# EAGLE design fallBz2 (EAGLE 7.4.0)
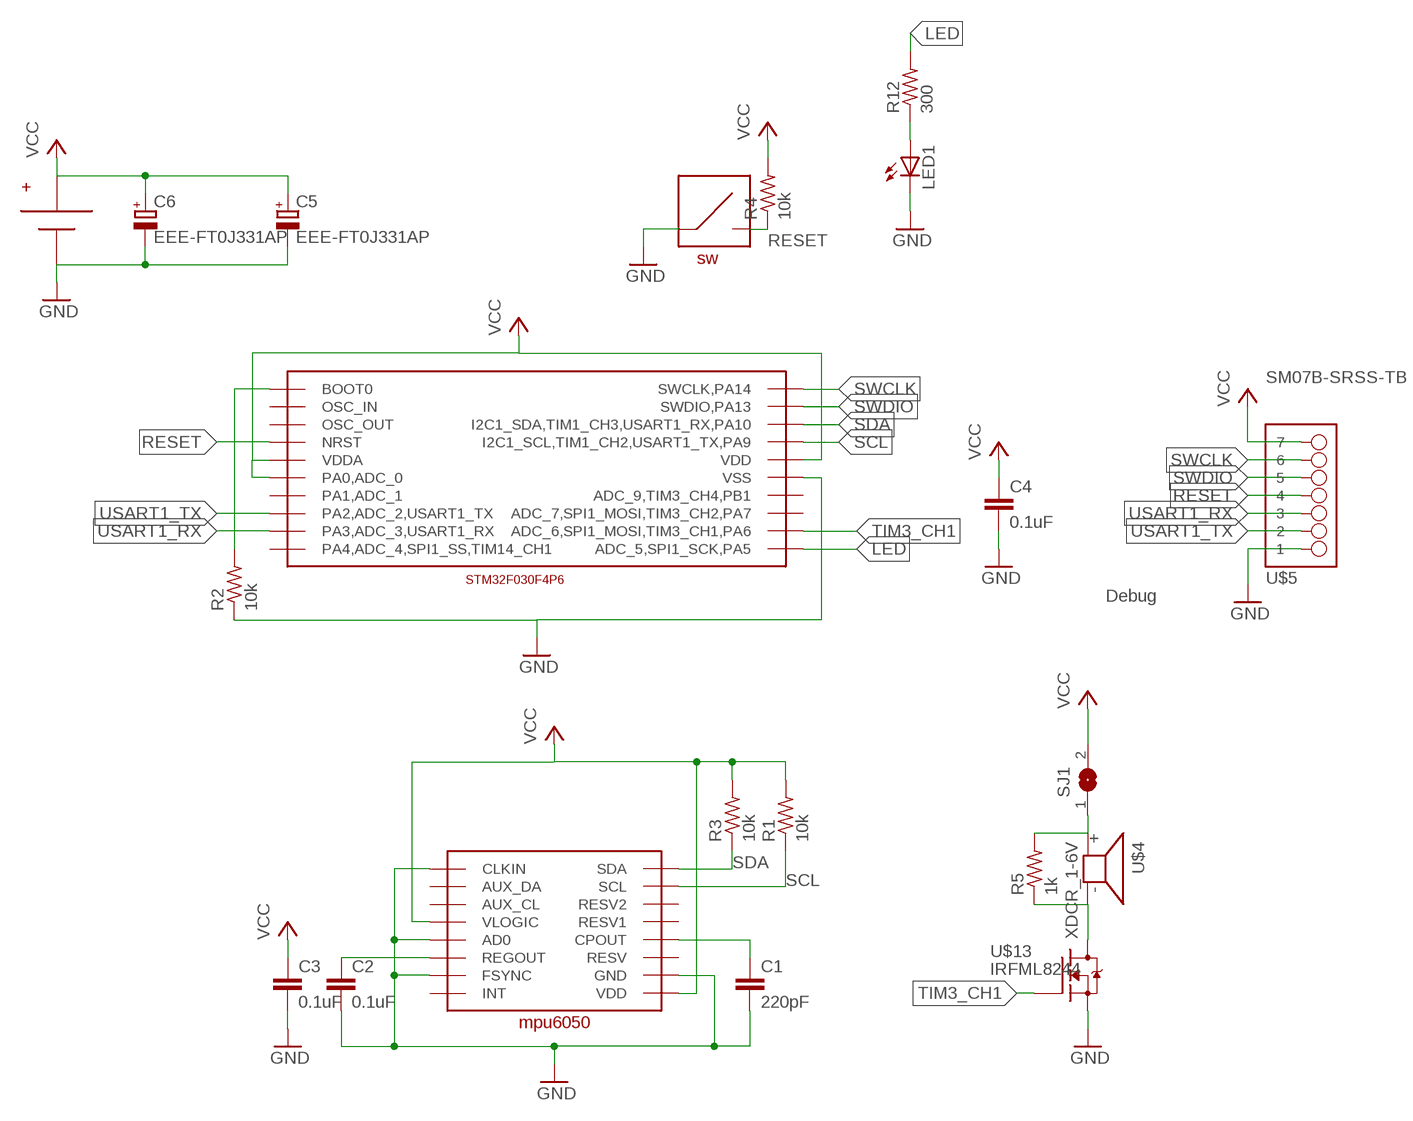
[diagram p0: schematic, sheet 1]

## Parts
C1  220pF  C-EUC0603K  [C0603K]
C2  0.1uF  C-EUC0603K  [C0603K]
C3  0.1uF  C-EUC0603K  [C0603K]
C4  0.1uF  C-EUC0603K  [C0603K]
C5  EEE-FT0J331AP  CPOL-EU153CLV-0605  [153CLV-0605]
C6  EEE-FT0J331AP  CPOL-EU153CLV-0605  [153CLV-0605]
LED1  LEDCHIP-LED0603  [CHIP-LED0603]
R1  10k  R-US_R0603  [R0603]
R2  10k  R-US_R0603  [R0603]
R3  10k  R-US_R0603  [R0603]
R4  10k  R-US_R0603  [R0603]
R5  1k  R-US_R0603  [R0603]
R12  300  R-US_R0603  [R0603]
SJ1  SJ  [SJ]
U$1  STM-TSSOP20  [STM-TSSOP20]
U$2  BAT_BK-912  [BAT_BK-912]
U$3  MPU6050  [MPU6050]
U$4  XDCR_1-6V  [XDCR_1-6V]
U$5  SM07B-SRSS-TB  [SM07B-SRSS-TB]
U$7  KMT071-NGJ-LHS  [KMT071-NGJ-LHS]
U$13  IRFML8244  [SOT23]

## Nets
GND: C1.2 C2.2 C3.2 C4.2 C5.- C6.- LED1.C R2.1 U$1.P$15(VSS) U$2.MINUS(MINSU) U$3.AD0 U$3.CLKIN U$3.FSYNC U$3.GND U$5.P$1 U$7.SW00 U$7.SW0 U$13.2(S)
LED: R12.2 U$1.P$11(ADC_5,SPI1_SCK,PA5)
N$1: C2.1 U$3.REGOUT
N$2: R5.2 SJ1.1 U$4.PLUS
N$3: R5.1 U$4.MINUS U$13.3(D)
N$5: C1.1 U$3.CPOUT
N$8: R2.2 U$1.P$1(BOOT0)
N$16: LED1.A R12.1
RESET: R4.1 U$1.P$4(NRST) U$5.P$4 U$7.SW1 U$7.SW11
SCL: R1.1 U$1.P$17(I2C1_SCL,TIM1_CH2,USART1_TX,PA9) U$3.SCL
SDA: R3.1 U$1.P$18(I2C1_SDA,TIM1_CH3,USART1_RX,PA10) U$3.SDA
SWCLK: U$1.P$20(SWCLK,PA14) U$5.P$6
SWDIO: U$1.P$19(SWDIO,PA13) U$5.P$5
TIM3_CH1: U$1.P$12(ADC_6,SPI1_MOSI,TIM3_CH1,PA6) U$13.1(G)
USART1_RX: U$1.P$9(PA3,ADC_3,USART1_RX) U$5.P$3
USART1_TX: U$1.P$8(PA2,ADC_2,USART1_TX) U$5.P$2
VCC: C3.1 C4.1 C5.+ C6.+ R1.2 R3.2 R4.2 SJ1.2 U$1.P$5(VDDA) U$1.P$6(PA0,ADC_0) U$1.P$16(VDD) U$2.P$1(PLUS) U$2.P$2(PLUS) U$3.VDD U$3.VLOGIC U$5.P$7
Unconnected: U$1.P$2(OSC_IN) U$1.P$3(OSC_OUT) U$1.P$7(PA1,ADC_1) U$1.P$10(PA4,ADC_4,SPI1_SS,TIM14_CH1) U$1.P$13(ADC_7,SPI1_MOSI,TIM3_CH2,PA7) U$1.P$14(ADC_9,TIM3_CH4,PB1) U$3.AUX_CL U$3.AUX_DA U$3.INT U$3.RESV U$3.RESV1 U$3.RESV2

## Notes on the sheet
- Debug

## Library data of the parts
C1-C4 = resistor:C-EU: CAPACITOR, European symbol
C5 C6 = rcl:CPOL-EU: POLARIZED CAPACITOR, European symbol
LED1 = led:LED: LED OSRAM: - CHIPLED LG R971, LG N971, LY N971, LG Q971, LY Q971, LO R971, LY R971 LH N974, LH R974 LS Q976, LO Q976, LY Q976 LO Q996 - Hyper CHIPLED LW Q18S LB Q993, LB Q99A, LB R99A - SideLED LS A670, LO A670, LY A670, LG A670, LP A670 LB A673, LV A673, LT A673, LW A673 LH A674 LY A675 LS A676, LA A676, LO A676, LY A676, LW A676 LS A679, LY A679, LG A679 - Hyper Micro SIDELED® LS Y876, LA Y876, LO Y876, LY Y876 LT Y87S - SmartLED LW L88C, LW L88S LB L89C, LB L89S, LG L890 LS L89K, LO L89K, LY L89K LS L896, LA L896, LO L896, LY L896 - TOPLED LS T670, LO T670, LY T670, LG T670, LP T670 LSG T670, LSP T670, LSY T670, LOP T670, LYG T670 LG T671, LOG T671, LSG T671 LB T673, LV T673, LT T673, LW T673 LH T674 LS T676, LA T676, LO T676, LY T676, LB T676, LH T676, LSB T676, LW T676 LB T67C, LV T67C, LT T67C, LS T67K, LO T67K, LY T67K, LW E67C LS E67B, LA E67B, LO E67B, LY E67B, LB E67C, LV E67C, LT E67C LW T67C LS T679, LY T679, LG T679 LS T770, LO T770, LY T770, LG T770, LP T770 LB T773, LV T773, LT T773, LW T773 LH T774 LS E675, LA E675, LY E675, LS T675 LS T776, LA T776, LO T776, LY T776, LB T776 LHGB T686 LT T68C, LB T68C - Hyper Mini TOPLED® LB M676 - Mini TOPLED Santana® LG M470 LS M47K, LO M47K, LY M47K Source: http://www.osram.convergy.de LUXEON: - LUMILED® LXK2-PW12-R00, LXK2-PW12-S00, LXK2-PW14-U00, LXK2-PW14-V00 LXK2-PM12-R00, LXK2-PM12-S00, LXK2-PM14-U00 LXK2-PE12-Q00, LXK2-PE12-R00, LXK2-PE12-S00, LXK2-PE14-T00, LXK2-PE14-U00 LXK2-PB12-K00, LXK2-PB12-L00, LXK2-PB12-M00, LXK2-PB14-N00, LXK2-PB14-P00, LXK2-PB14-Q00 LXK2-PR12-L00, LXK2-PR12-M00, LXK2-PR14-Q00, LXK2-PR14-R00 LXK2-PD12-Q00, LXK2-PD12-R00, LXK2-PD12-S00 LXK2-PH12-R00, LXK2-PH12-S00 LXK2-PL12-P00, LXK2-PL12-Q00, LXK2-PL12-R00 Source: www.luxeon.com KINGBRIGHT: KA-3528ASYC Source: www.kingbright.com
R1-R5 R12 = resistor:R-US_: RESISTOR, American symbol
SJ1 = jumper:SJ: SMD solder JUMPER
U$1 = STM-tssop20:STM-TSSOP20
U$2 = BAT_BK-912:BAT_BK-912
U$3 = MPU6050:MPU6050
U$4 = buzzer:XDCR_1-6V
U$5 = con-jst-sh:SM07B-SRSS-TB
U$7 = KMT071-NGJ-LHS:KMT071-NGJ-LHS
U$13 = transistor-fet:IRFML8244

## Board
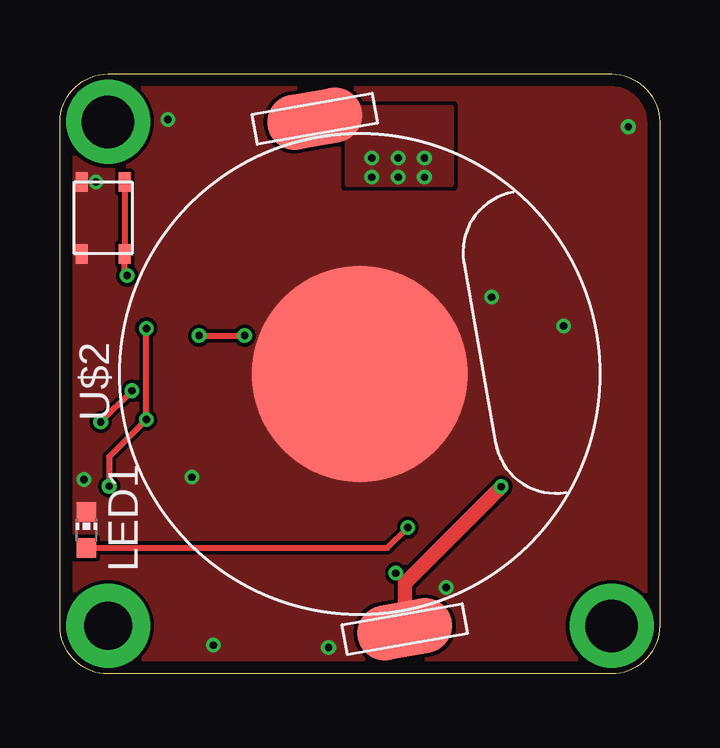
[diagram p1: board, top side]
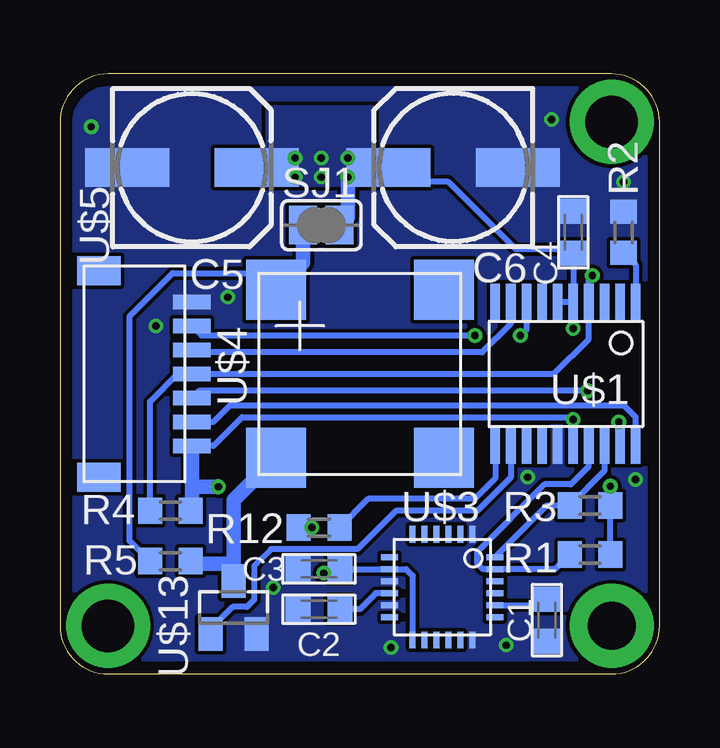
[diagram p2: board, bottom side, seen from below]

Size 25 x 25 mm. Coordinates in mm from the lower left corner, seen from the top.
Outline: 23,25 arc-90 25,23 25,2 arc-90 23,0 2,0 arc-90 0,2 0,23 arc-90 2,25 23,25
Copper layers (1*16): Top 0.035mm / dielectric 1.6mm / Bottom 0.035mm
Design rules "Elecrow_2-layer_PCB_eagle_rule": minimum track width 6mil, minimum drill 12mil, track to track 6mil, track to pad 6mil, pad to pad 6mil, via to via 8mil, smd to smd 0mil, copper to edge 20mil, drill to drill 10mil, minimum pad ring 6mil, minimum via ring 6mil, stop-mask expansion 0mil, vias tented up to drill 100mil, thermal gap 10mil

### Footprints (pad centres in the part's own frame; a part is rotated, then mirrored left to right if it is on the bottom)
C0603K = smd 1.05 x 1.08: 1 -0.875,0; 2 0.875,0
153CLV-0605 = smd 3.5 x 1.6: + 2.7,0; - -2.7,0
CHIP-LED0603 = smd 0.8 x 0.8: A 0,-0.75; C 0,0.75
R0603 = smd 1 x 1.1: 1 -0.85,0; 2 0.85,0
SJ = smd 1.168 x 1.6: 1 -0.762,0; 2 0.762,0
STM-TSSOP20 = smd 0.4 x 1.5: P$1 -2.8,-3; P$2 -2.15,-3; P$3 -1.5,-3; P$4 -0.85,-3; P$5 -0.2,-3; P$6 0.45,-3; P$7 1.1,-3; P$8 1.75,-3; P$9 2.4,-3; P$10 3.05,-3; P$11 3.05,3; P$12 2.4,3; P$13 1.75,3; P$14 1.1,3; P$15 0.45,3; P$16 -0.2,3; P$17 -0.85,3; P$18 -1.5,3; P$19 -2.15,3; P$20 -2.8,3
BAT_BK-912 = smd 9 x 9: MINUS 0,0 | smd 2.3 x 4: P$1 -10.8,0; P$2 10.8,0
MPU6050 = smd 0.25 x 0.7: AD0 -0.25,-2.2; AUX_CL -1.25,-2.2; CPOUT 0.75,2.2; FSYNC 0.75,-2.2; INT 1.25,-2.2; REGOUT 0.25,-2.2; RESV 1.25,2.2; RESV1 0.25,2.2; RESV2 -0.25,2.2; SCL -0.75,2.2; SDA -1.25,2.2; VLOGIC -0.75,-2.2 | smd 0.7 x 0.25: AUX_DA -2.2,-1.25; CLKIN -2.2,1.25; GND 2.2,1.25; P$2 -2.2,0.75; P$3 -2.2,0.25; P$4 -2.2,-0.25; P$5 -2.2,-0.75; P$14 2.2,-0.75; P$15 2.2,-0.25; P$16 2.2,0.25; P$17 2.2,0.75; VDD 2.2,-1.25
XDCR_1-6V = smd 2.5 x 2.5: MINUS 3.5,3.5; P$1 -3.5,3.5; P$2 -3.5,-3.5; PLUS 3.5,-3.5
SM07B-SRSS-TB = smd 0.6 x 1.55: P$1 -3,0; P$2 -2,0; P$3 -1,0; P$4 0,0; P$5 1,0; P$6 2,0; P$7 3,0 | smd 1.2 x 1.8: P$8 -4.3,-3.875; P$9 4.3,-3.875
KMT071-NGJ-LHS = smd 0.8 x 0.5: SW0 -1.5,0.9; SW00 1.5,0.9; SW1 1.5,-0.9; SW11 -1.5,-0.9
SOT23 = smd 1 x 1.4: 1 -0.95,-1.1; 2 0.95,-1.1; 3 0,1.1

### Placement (x,y rotation side)
C1  4.7,2.24 270 bottom
C2  14.2,2.7 180 bottom
C3  14.2,4.38 180 bottom
C4  3.6,18.4 90 bottom
C5  19.5,21.1 0 bottom
C6  8.6,21.1 180 bottom
LED1  1.1,6 0 top
R1  2.9,4.98 0 bottom
R2  1.5,18.4 270 bottom
R3  2.9,7.02 0 bottom
R4  20.4,6.8 0 bottom
R5  20.4,4.7 180 bottom
R12  14.2,6.1 0 bottom
SJ1  14.1,18.7 0 bottom
U$1  3.8,12.5 180 bottom
U$2  12.5,12.5 280 top
U$3  9.06,3.62 270 bottom
U$4  12.5,12.5 180 bottom
U$5  19.5,12.5 270 bottom
U$7  1.8,19 90 top
U$13  17.76,2.77 0 bottom

### Tracks (layer width: path | path; a pad name or v marks a point on that pad's centre or on a via)
GND  (via drill 0.3)
  other vias: 1.5,20.5 4.5,23.1 23.7,22.8 1,8.1 6.4,1.2 21,14.5 18,15.7 11.2,1.1 5.5,8.2 16.1,3.6
  pour Bottom (rank 6, no thermals): -1.2,26.3 27,26.3 27,-1.4 -1.2,-1.4
  pour Top (rank 6, no thermals): -2,27 29.7,27 29.7,-3.1 -2,-3.1
LED
  Bottom 0.254: U$1.P$11 6.85,8.15 7.7,7.3 12.15,7.3 R12.2
N$1
  Bottom 0.254: U$3.REGOUT 11.83,3.37 12.5,2.7 C2.1
N$2
  Bottom 0.254: R5.2 22.1,5.55 22.1,14.9 20.3,16.7 16.7,16.7 U$4.PLUS
  Bottom 0.61: SJ1.1 14.86,17.14 U$4.PLUS
N$3
  Bottom 0.61: U$4.MINUS 17.76,7.24 17.76,4.6 | 17.76,4.6 U$13.3 | R5.1 19.45,4.6 17.76,4.6
N$4  (via drill 2.2 pad 3.5)
  other vias: 2,23
N$5
  Bottom 0.254: U$3.CPOUT 4.95,2.87 C1.1
N$7  (via drill 2.2 pad 3.5)
  other vias: 23,2
N$8
  Bottom 0.254: R2.2 1,17.05 U$1.P$1
N$9  (via drill 2 pad 3.5)
  other vias: 2,2
N$16  (via drill 0.3)
  Top 0.254: LED1.A 13.65,5.25 v14.5,6.1
  Bottom 0.254: v14.5,6.1 R12.1
RESET  (via drill 0.3)
  Top 0.254: U$7.SW1 U$7.SW11 2.7,16.7 v2.8,16.6
  Bottom 0.254: v2.8,16.6 2.95,16.45 U$1.P$4 2.95,13.95 4.4,12.5 U$5.P$4 20.1,12.5 21.25,11.35 R4.1
SCL
  Bottom 0.254: U$1.P$17 2.95,8.65 3.7,7.9 4.8,7.9 7.6,5.1 7.6,4.6 7.37,4.37 U$3.SCL 4.36,4.37 R1.1
SDA
  Bottom 0.254: U$3.SDA 4.71,7.02 R3.1 2.3,8.47 U$1.P$18
SWCLK
  Bottom 0.254: U$1.P$20 1,10.7 1.5,11.2 17.9,11.2 18.6,10.5 U$5.P$6
SWDIO  (via drill 0.3)
  Top 0.254: v1.7,10.5 v3,11.8
  Bottom 0.254: U$1.P$19 1.65,10.45 v1.7,10.5 | v3,11.8 19.2,11.8 U$5.P$5
TIM3_CH1
  Bottom 0.254: U$1.P$12 6.2,8.2 7.6,6.8 11,6.8 12.6,5.2 16.2,5.2 16.9,4.5 16.9,3.1 17.2,2.8 17.8,2.8 18.71,1.89 U$13.1 18.33,1.67
USART1_RX
  Bottom 0.254: U$1.P$9 6.2,14.6 7.4,13.4 19.4,13.4 U$5.P$3
USART1_TX  (via drill 0.3)
  Top 0.254: v5.8,14.1 v7.7,14.1
  Bottom 0.254: U$1.P$8 5.55,14.35 v5.8,14.1 | v7.7,14.1 19.1,14.1 U$5.P$2
VCC  (via drill 0.3)
  Top 0.254: v3.6,14.4 v3.6,10.6 2.05,9.05 v2.05,7.82 | 14.38,3.77 14.38,3.83 v14,4.2
  Top 0.61: U$2.P$2 14.38,3.77 v18.4,7.8
  Bottom 0.254: U$1.P$6 U$1.P$5 | U$1.P$16 v3.6,10.6 3.7,10.7 17.4,10.7 18.6,9.5 U$5.P$7 | v3.6,14.4 U$1.P$5 | U$1.P$5 C4.1 3.77,17.7 6,17.7 8.8,20.5 10,20.5 10.6,21.1 C6.+ | v14,4.2 13.82,4.38 C3.1 U$3.VLOGIC 10.57,4.37 10.3,4.1 U$3.VDD | v2.05,7.82 R3.2 R1.2
  Bottom 0.61: v13,20.7 13,19.04 SJ1.2 | 19.5,7.8 U$5.P$7 | v18.4,7.8 19.5,7.8 | R4.2 19.5,6.85 19.5,7.8
  other vias: 13,21.5 14.1,21.5 15.2,21.5 15.2,20.7 14.1,20.7
  pour Bottom (no thermals): 16.3,23.6 12,23.6 12,20.4 16.3,20.4
  pour Top (rank 2, no thermals): 12,23.6 16.3,23.6 16.3,20.4 12,20.4